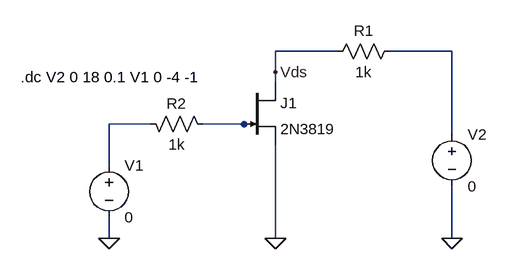
[diagram p0: schematic jfet.asc]
jfet.asc, the LTspice schematic file:
Version 4
SHEET 1 880 680
WIRE 368 112 272 112
WIRE 544 112 448 112
WIRE 272 144 272 112
WIRE 272 160 272 144
WIRE 80 224 16 224
WIRE 224 224 160 224
WIRE 240 224 224 224
WIRE 544 240 544 112
WIRE 16 288 16 224
WIRE 16 400 16 368
WIRE 272 400 272 256
WIRE 544 400 544 320
FLAG 16 400 0
FLAG 544 400 0
FLAG 272 400 0
FLAG 272 144 Vds
SYMBOL njf 224 160 R0
SYMATTR InstName J1
SYMATTR Value 2N3819
SYMBOL res 64 208 M90
WINDOW 0 0 56 VBottom 2
WINDOW 3 32 56 VTop 2
SYMATTR InstName R2
SYMATTR Value 1k
SYMBOL voltage 16 272 R0
WINDOW 123 0 0 Left 0
WINDOW 39 0 0 Left 0
SYMATTR InstName V1
SYMATTR Value 0
SYMBOL voltage 544 224 R0
WINDOW 123 0 0 Left 0
WINDOW 39 0 0 Left 0
SYMATTR InstName V2
SYMATTR Value 0
SYMBOL res 464 96 R90
WINDOW 0 0 56 VBottom 2
WINDOW 3 32 56 VTop 2
SYMATTR InstName R1
SYMATTR Value 1k
TEXT -120 152 Left 2 !.dc V2 0 18 0.1 V1 0 -4 -1

The netlist it stands for:
* jfet.asc
J1 Vds N003 0 2N3819
R2 N002 N003 1k
V1 N002 0 0
V2 N001 0 0
R1 N001 Vds 1k
.model NJF NJF
.model PJF PJF
.lib standard.jft
.dc V2 0 18 0.1 V1 0 -4 -1
.backanno
.end